# Altium schematic sheet TopLevel.SchDoc: =project_title
size Tabloid; PageSetup: Record=PageOptions|CenterHorizontal=True|CenterVertical=True|PrintScale=0.73|XCorrection=1.00|YCorrection=1.00|PrintKind=0|BorderSize=5000000|LeftOffset=0|BottomOffset=0|Orientation=2|PaperLength=1000|PaperWidth=1000|Scale=100|PaperSource=7|PrintQuality=-4|MediaType=1|DitherType=10|PaperKind=A4|PrintScaleMode=1; CompanyName: Luxonis Holding; Organization: Luxonis Holding; Address1: 1925 Harmony Park Drive; Address2: Westminster, CO; Address3: 80234; Address4: United States; SheetNumber: 2; SheetTotal: 9
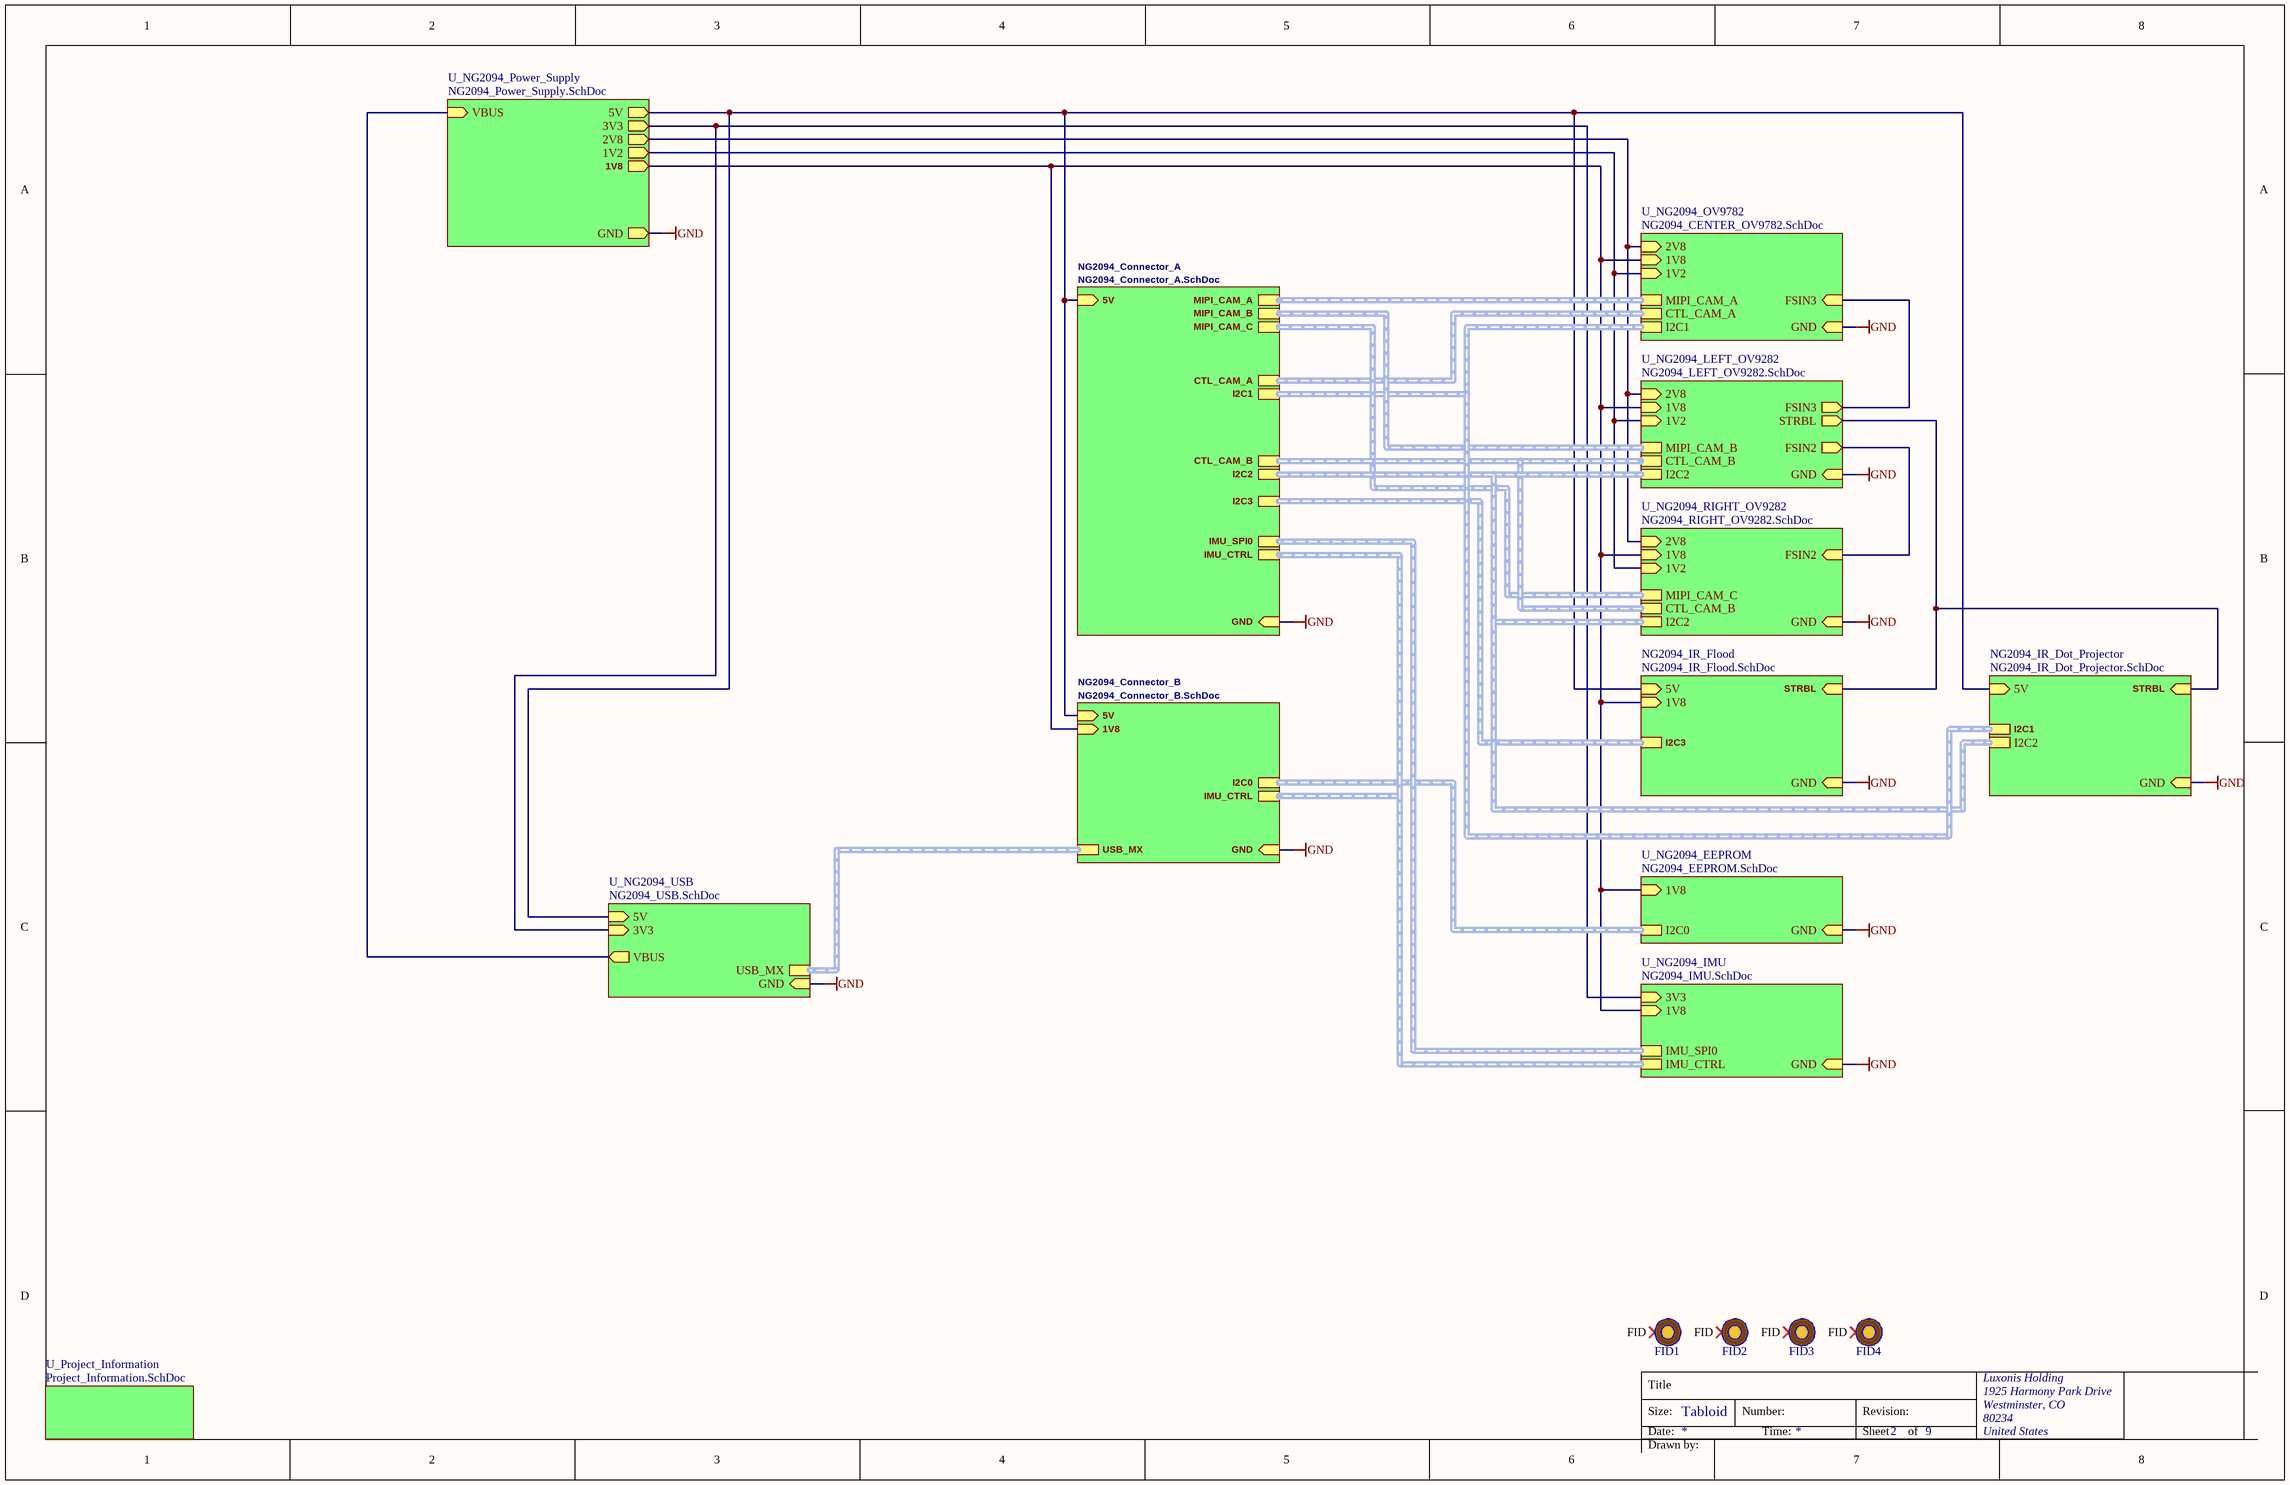
[diagram p0: TopLevel.SchDoc]

## Parts
FID1  FIDUCIAL_ROUND_1MM  [FIDUCIAL_ROUND_1MM]  (value not drawn)  (no BOM)
FID2  FIDUCIAL_ROUND_1MM  [FIDUCIAL_ROUND_1MM]  (value not drawn)  (no BOM)
FID3  FIDUCIAL_ROUND_1MM  [FIDUCIAL_ROUND_1MM]  (value not drawn)  (no BOM)
FID4  FIDUCIAL_ROUND_1MM  [FIDUCIAL_ROUND_1MM]  (value not drawn)  (no BOM)

## Sub-sheets
NG2094_Connector_A = NG2094_Connector_A.SchDoc: IMU_CTRL (harness IMU_CTRL), IMU_SPI0 (harness MX_SPI0), MIPI_CAM_C (harness MIPI_CAM_C), MIPI_CAM_A (harness MIPI_CAM_A), MIPI_CAM_B (harness MIPI_CAM_B), I2C2 (harness I2C2), I2C1 (harness I2C1), CTL_CAM_A (harness CTL_CAM_A), CTL_CAM_B (harness CTL_CAM_B), I2C3 (harness I2C3), 5V (in), GND (in)
NG2094_Connector_B = NG2094_Connector_B.SchDoc: USB_MX (harness USB), 5V (in), GND (in), IMU_CTRL (harness IMU_CTRL), I2C0 (harness I2C0), 1V8 (in)
NG2094_IR_Dot_Projector = NG2094_IR_Dot_Projector.SchDoc: I2C2 (harness I2C2), GND (in), 5V (in), STRBL (in), I2C1 (harness I2C1)
NG2094_IR_Flood = NG2094_IR_Flood.SchDoc: 1V8 (in), GND (in), 5V (in), I2C3 (harness I2C3), STRBL (in)
U_NG2094_EEPROM = NG2094_EEPROM.SchDoc: I2C0 (harness I2C0), 1V8 (in), GND (in)
U_NG2094_IMU = NG2094_IMU.SchDoc: IMU_CTRL (harness IMU_CTRL), 1V8 (in), GND (in), IMU_SPI0 (harness MX_SPI0), 3V3 (in)
U_NG2094_LEFT_OV9282 = NG2094_LEFT_OV9282.SchDoc: I2C2 (harness I2C1), MIPI_CAM_B (harness MIPI_CAM_A), CTL_CAM_B (harness CTL_CAM_A), GND (in), 1V8 (in), 2V8 (in), 1V2 (in), FSIN2 (out), STRBL (out), FSIN3 (out)
U_NG2094_OV9782 = NG2094_CENTER_OV9782.SchDoc: I2C1 (harness I2C1), MIPI_CAM_A (harness MIPI_CAM_A), CTL_CAM_A (harness CTL_CAM_A), GND (in), 1V8 (in), 2V8 (in), 1V2 (in), FSIN3 (in)
U_NG2094_Power_Supply = NG2094_Power_Supply.SchDoc: 5V (out), 2V8 (out), 3V3 (out), GND (out), VBUS (in), 1V2 (out), 1V8 (out)
U_NG2094_RIGHT_OV9282 = NG2094_RIGHT_OV9282.SchDoc: I2C2 (harness I2C1), MIPI_CAM_C (harness MIPI_CAM_A), CTL_CAM_B (harness CTL_CAM_A), GND (in), 1V8 (in), 2V8 (in), 1V2 (in), FSIN2 (in)
U_NG2094_USB = NG2094_USB.SchDoc: USB_MX (harness USB), VBUS (out), GND (in), 3V3 (in), 5V (in)
U_Project_Information = Project_Information.SchDoc: no entries

## Nets
GND: sheet U_NG2094_OV9782/GND, sheet U_NG2094_USB/GND, sheet U_NG2094_EEPROM/GND, sheet U_NG2094_Power_Supply/GND, sheet U_NG2094_LEFT_OV9282/GND, sheet U_NG2094_RIGHT_OV9282/GND, sheet U_NG2094_IMU/GND, sheet NG2094_IR_Flood/GND, sheet NG2094_Connector_A/GND, sheet NG2094_Connector_B/GND, sheet NG2094_IR_Dot_Projector/GND
(unnamed): sheet U_NG2094_OV9782/1V8, sheet U_NG2094_EEPROM/1V8, sheet U_NG2094_Power_Supply/1V8, sheet U_NG2094_LEFT_OV9282/1V8, sheet U_NG2094_RIGHT_OV9282/1V8, sheet U_NG2094_IMU/1V8, sheet NG2094_IR_Flood/1V8, sheet NG2094_Connector_B/1V8
(unnamed): sheet U_NG2094_OV9782/2V8, sheet U_NG2094_Power_Supply/2V8, sheet U_NG2094_LEFT_OV9282/2V8, sheet U_NG2094_RIGHT_OV9282/2V8
(unnamed): sheet U_NG2094_OV9782/1V2, sheet U_NG2094_Power_Supply/1V2, sheet U_NG2094_LEFT_OV9282/1V2, sheet U_NG2094_RIGHT_OV9282/1V2
(unnamed): sheet U_NG2094_OV9782/FSIN3, sheet U_NG2094_LEFT_OV9282/FSIN3
(unnamed): sheet U_NG2094_USB/VBUS, sheet U_NG2094_Power_Supply/VBUS
(unnamed): sheet U_NG2094_USB/3V3, sheet U_NG2094_Power_Supply/3V3, sheet U_NG2094_IMU/3V3
(unnamed): sheet U_NG2094_USB/5V, sheet U_NG2094_Power_Supply/5V, sheet NG2094_IR_Flood/5V, sheet NG2094_Connector_A/5V, sheet NG2094_Connector_B/5V, sheet NG2094_IR_Dot_Projector/5V
(unnamed): sheet U_NG2094_LEFT_OV9282/FSIN2, sheet U_NG2094_RIGHT_OV9282/FSIN2
(unnamed): sheet U_NG2094_LEFT_OV9282/STRBL, sheet NG2094_IR_Flood/STRBL, sheet NG2094_IR_Dot_Projector/STRBL

Not connected (* = marked no-connect by the designer): FID1 FID*; FID2 FID*; FID3 FID*; FID4 FID*

## Buses and harness runs
harness sheet NG2094_Connector_A/CTL_CAM_A = sheet U_NG2094_OV9782/CTL_CAM_A
harness sheet NG2094_Connector_A/CTL_CAM_B = sheet U_NG2094_LEFT_OV9282/CTL_CAM_B = sheet U_NG2094_RIGHT_OV9282/CTL_CAM_B
harness sheet NG2094_Connector_A/I2C1 = sheet NG2094_IR_Dot_Projector/I2C1 = sheet U_NG2094_OV9782/I2C1
harness sheet NG2094_Connector_A/I2C2 = sheet NG2094_IR_Dot_Projector/I2C2 = sheet U_NG2094_LEFT_OV9282/I2C2 = sheet U_NG2094_RIGHT_OV9282/I2C2
harness sheet NG2094_Connector_A/I2C3 = sheet NG2094_IR_Flood/I2C3
harness sheet NG2094_Connector_A/IMU_CTRL = sheet NG2094_Connector_B/IMU_CTRL = sheet U_NG2094_IMU/IMU_CTRL
harness sheet NG2094_Connector_A/IMU_SPI0 = sheet U_NG2094_IMU/IMU_SPI0
harness sheet NG2094_Connector_A/MIPI_CAM_A = sheet U_NG2094_OV9782/MIPI_CAM_A
harness sheet NG2094_Connector_A/MIPI_CAM_B = sheet U_NG2094_LEFT_OV9282/MIPI_CAM_B
harness sheet NG2094_Connector_A/MIPI_CAM_C = sheet U_NG2094_RIGHT_OV9282/MIPI_CAM_C
harness sheet NG2094_Connector_B/I2C0 = sheet U_NG2094_EEPROM/I2C0
harness sheet NG2094_Connector_B/USB_MX = sheet U_NG2094_USB/USB_MX

## Notes on the sheet
- Title
- Size:
- Date:
- Tabloid
- Number:
- Time:
- Revision:
- Sheet
- of
- Drawn by:

## Library data of the parts
FID1-FID4 = FIDUCIAL: Fiducial with various available footprints